# Altium schematic sheet main.SchDoc
size A3
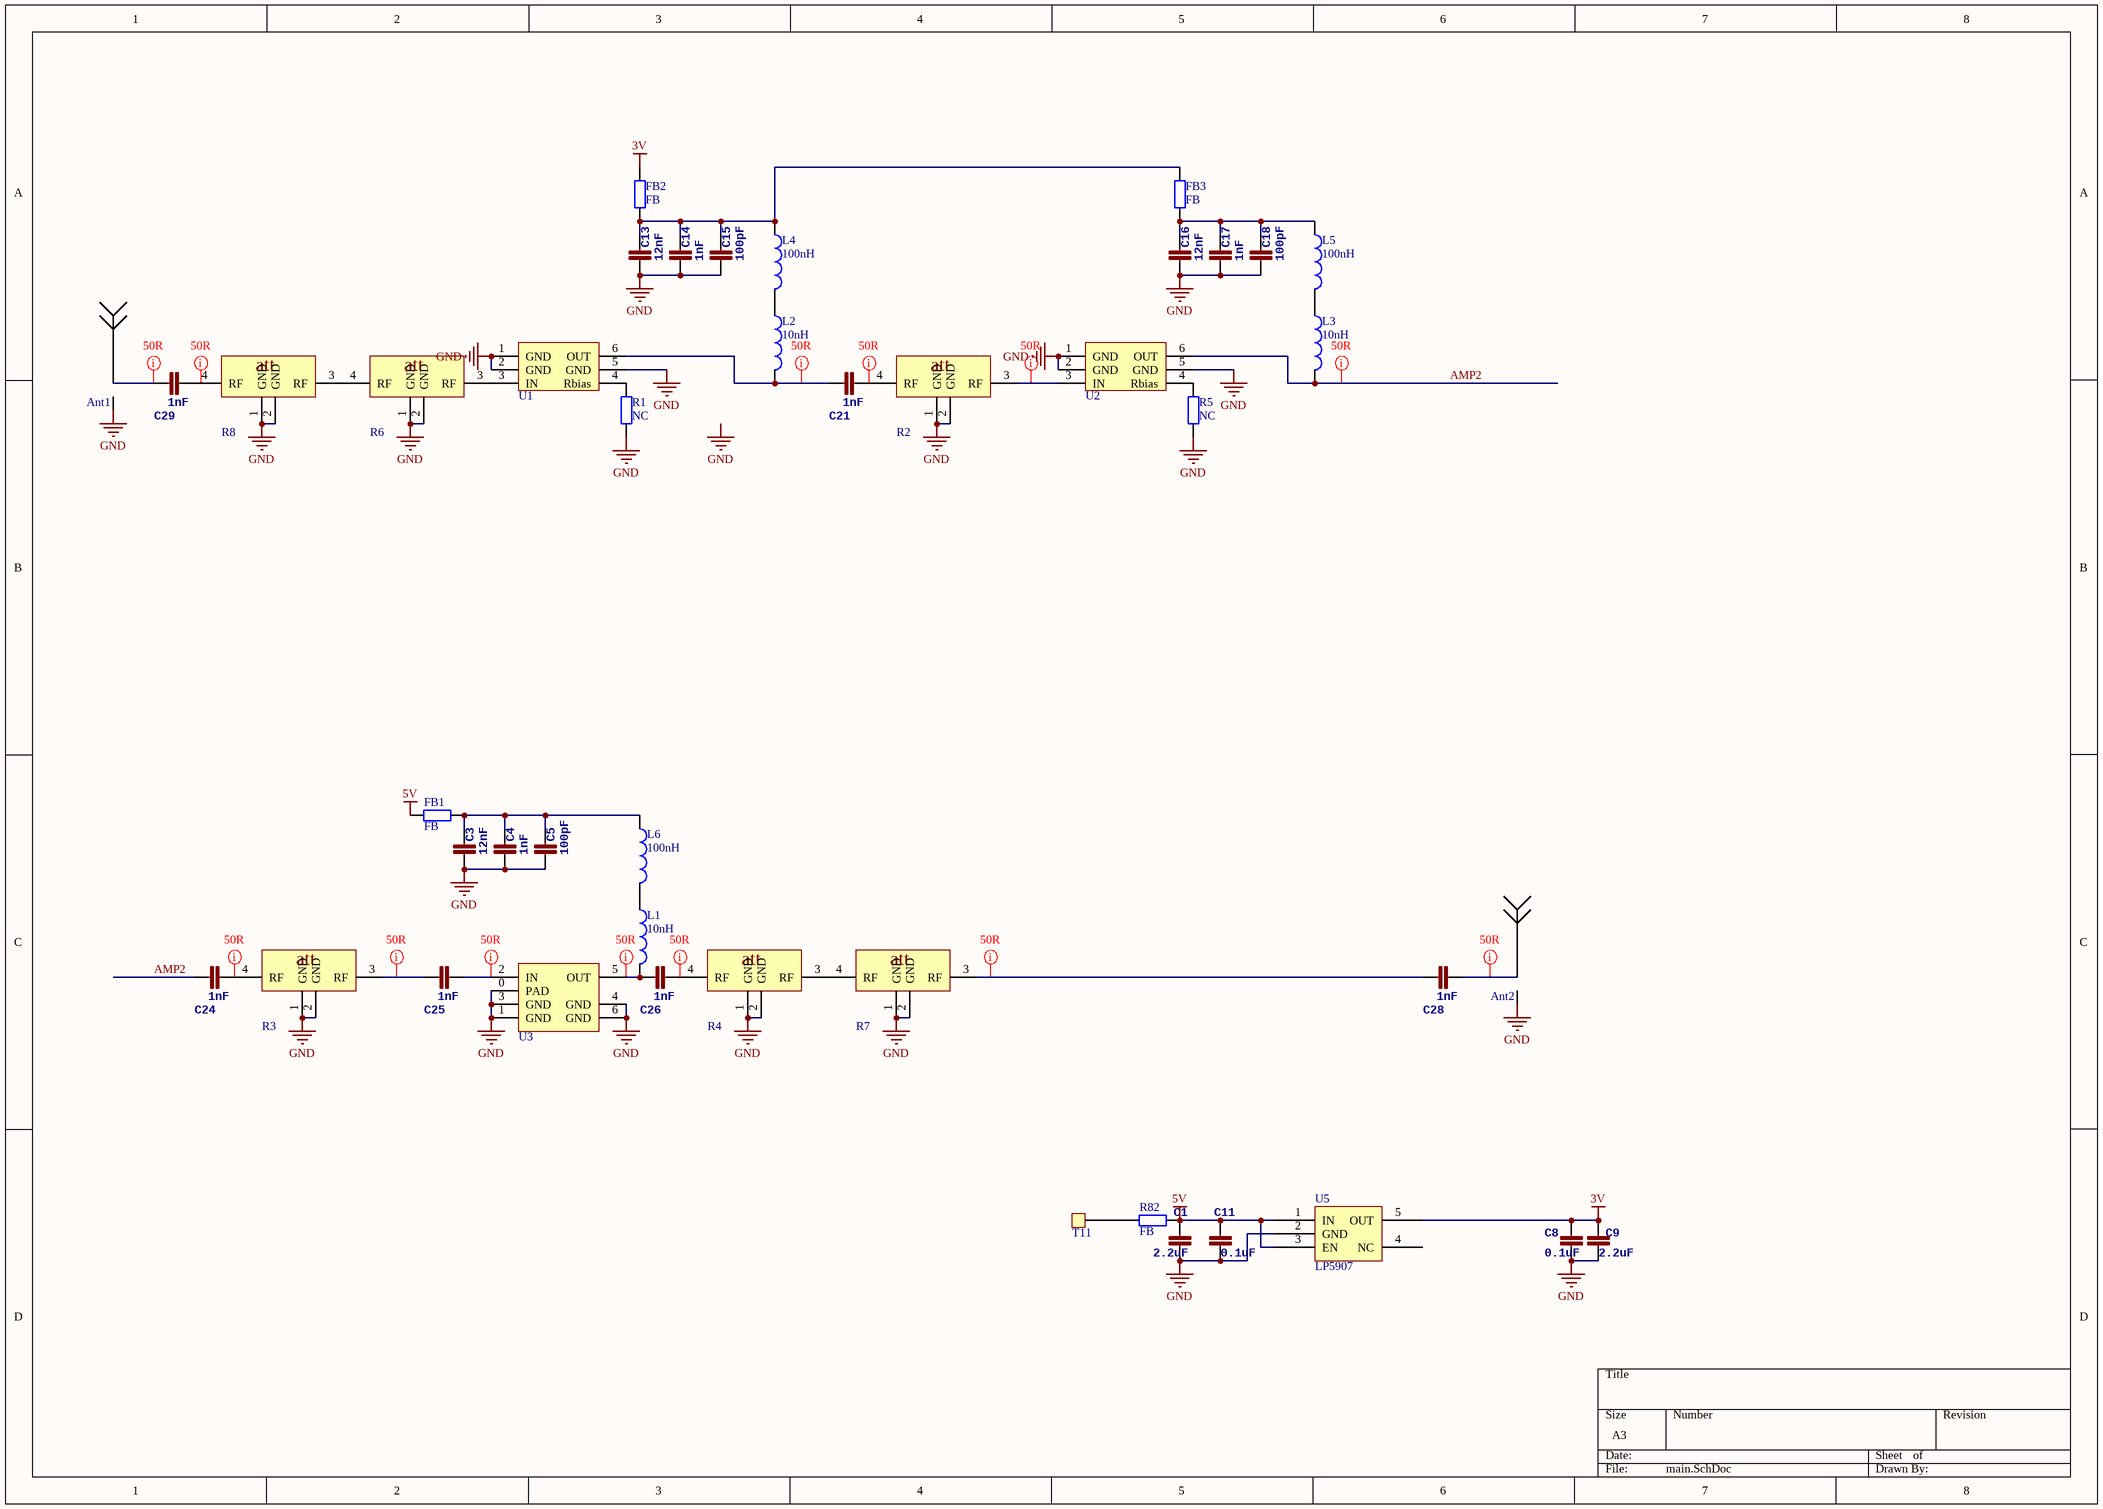
[diagram p0: main.SchDoc]

## Parts
Ant1  Antenna  [SMA-2]  (value not drawn)
Ant2  Antenna  [SMA-2]  (value not drawn)
C1  2.2uF  [0603]
C3  12nF  [0805]
C4  1nF  [0402]
C5  100pF  [0402]
C8  0.1uF  [0603]
C9  2.2uF  [0603]
C11  0.1uF  [0402]
C13  12nF  [0805]
C14  1nF  [0402]
C15  100pF  [0402]
C16  12nF  [0805]
C17  1nF  [0402]
C18  100pF  [0402]
C21  1nF  [0402]
C24  1nF  [0402]
C25  1nF  [0402]
C26  1nF  [0402]
C28  1nF  [0402]
C29  1nF  [0402]
FB1  FB  [0603]
FB2  FB  [0603]
FB3  FB  [0603]
L1  value 10nH  [0402]  (hidden comment: Inductor)
L2  value 10nH  [0402]  (hidden comment: Inductor)
L3  value 10nH  [0402]  (hidden comment: Inductor)
L4  value 100nH  [0603L]  (hidden comment: Inductor)
L5  value 100nH  [0603L]  (hidden comment: Inductor)
L6  value 100nH  [0603L]  (hidden comment: Inductor)
R1  NC  [0402]
R2  EXB24-RF-ATT  [EXB24AT-RF-ATT]  (value not drawn)
R3  EXB24-RF-ATT  [EXB24AT-RF-ATT]  (value not drawn)
R4  EXB24-RF-ATT  [EXB24AT-RF-ATT]  (value not drawn)
R5  NC  [0402]
R6  EXB24-RF-ATT  [EXB24AT-RF-ATT]  (value not drawn)
R7  EXB24-RF-ATT  [EXB24AT-RF-ATT]  (value not drawn)
R8  EXB24-RF-ATT  [EXB24AT-RF-ATT]  (value not drawn)
R82  FB  [0603L]
T11  TestPad  [TestPad - 1mm]  (value not drawn)
U1  MGA85563  [SC-70-6]  (value not drawn)
U2  MGA85563  [SC-70-6]  (value not drawn)
U3  HMC788  [HMC788]  (value not drawn)
U5  LP5907  [SOT23-5]

## Nets
3V: C8.2 C9.2 FB2.2 U5.5(OUT)
5V: C1.2 C11.2 FB1.1 R82.1 U5.1(IN) U5.3(EN)
GND: Ant1.GND(G) Ant2.GND(G) C1.1 C3.1 C4.1 C5.1 C8.1 C9.1 C11.1 C13.1 C14.1 C15.1 C16.1 C17.1 C18.1 R1.1 R2.1(GND) R2.2(GND) R3.1(GND) R3.2(GND) R4.1(GND) R4.2(GND) R5.1 R6.1(GND) R6.2(GND) R7.1(GND) R7.2(GND) R8.1(GND) R8.2(GND) U1.1(GND) U1.2(GND) U1.5(GND) U2.1(GND) U2.2(GND) U2.5(GND) U3.0(PAD) U3.1(GND) U3.3(GND) U3.4(GND) U3.6(GND) U5.2(GND)
AMP2: C24.1 L3.2 U2.6(OUT)
NetAnt1_1: Ant1.1 C29.1
NetAnt2_1: Ant2.1 C28.2
NetC3_2: C3.2 C4.2 C5.2 FB1.2 L6.1
NetC13_2: C13.2 C14.2 C15.2 FB2.1 FB3.2 L4.1
NetC16_2: C16.2 C17.2 C18.2 FB3.1 L5.1
NetC21_1: C21.1 L2.2 U1.6(OUT)
NetC21_2: C21.2 R2.4(RF)
NetC24_2: C24.2 R3.4(RF)
NetC25_1: C25.1 R3.3(RF)
NetC25_2: C25.2 U3.2(IN)
NetC26_1: C26.1 L1.2 U3.5(OUT)
NetC26_2: C26.2 R4.4(RF)
NetC28_1: C28.1 R7.3(RF)
NetC29_2: C29.2 R8.4(RF)
NetL1_1: L1.1 L6.2
NetL2_1: L2.1 L4.2
NetL3_1: L3.1 L5.2
NetR1_2: R1.2 U1.4(Rbias)
NetR2_3: R2.3(RF) U2.3(IN)
NetR4_3: R4.3(RF) R7.4(RF)
NetR5_2: R5.2 U2.4(Rbias)
NetR6_3: R6.3(RF) U1.3(IN)
NetR6_4: R6.4(RF) R8.3(RF)
NetR82_2: R82.2 T11.1

Not connected (* = marked no-connect by the designer): U5 4(NC)

## Layout directives
net class 50R: (no net found under the mark), AMP2, NetAnt1_1, NetAnt2_1, NetC21_1, NetC21_2, NetC24_2, NetC25_1, NetC25_2, NetC26_1, NetC26_2, NetC28_1, NetR2_3

## Notes on the sheet
- Labels drawn without touching a wire or pin: GND
- (in symbol EXB24-RF-ATT) att

## Library data of the parts
C1 C3-C5 C8 C9 C11 C13-C18 C21 C24-C26 C28 C29 = CAP0402-CAP: <b>Capacitor</b> / Standard 0603 ceramic capacitor, and 0.1" leaded capacitor.; PARTNO: CC0402ZRY5V7BB104
FB1-FB3 R1 R5 = Res2: Resistor; Published: 8-Jun-2000; LatestRevisionDate: 17-Jul-2002; LatestRevisionNote: Re-released for DXP Platform.; PackageReference: AXIAL-0.4; Publisher: Altium Limited; PackageDescription: Axial Device, Thru-Hole; 2 Leads; 0.4 in Pin Spacing
L1-L6 = Inductor: Code_IEC: 1005; Published: 8-Jun-2000; LatestRevisionDate: 29-May-2009; LatestRevisionNote: IPC-7351 Footprint Added.; PackageReference: 0402-A; Publisher: Altium Limited; PackageDescription: Chip Inductor; Code_JEITA: 0402
R82 = Res2: Resistor; Value: 0Ohm; Published: 8-Jun-2000; LatestRevisionDate: 17-Jul-2002; LatestRevisionNote: Re-released for DXP Platform.; PackageReference: AXIAL-0.4; Publisher: Altium Limited; PackageDescription: Axial Device, Thru-Hole; 2 Leads; 0.4 in Pin Spacing